# EAGLE schematic Poloneira (EAGLE 9.1.0)
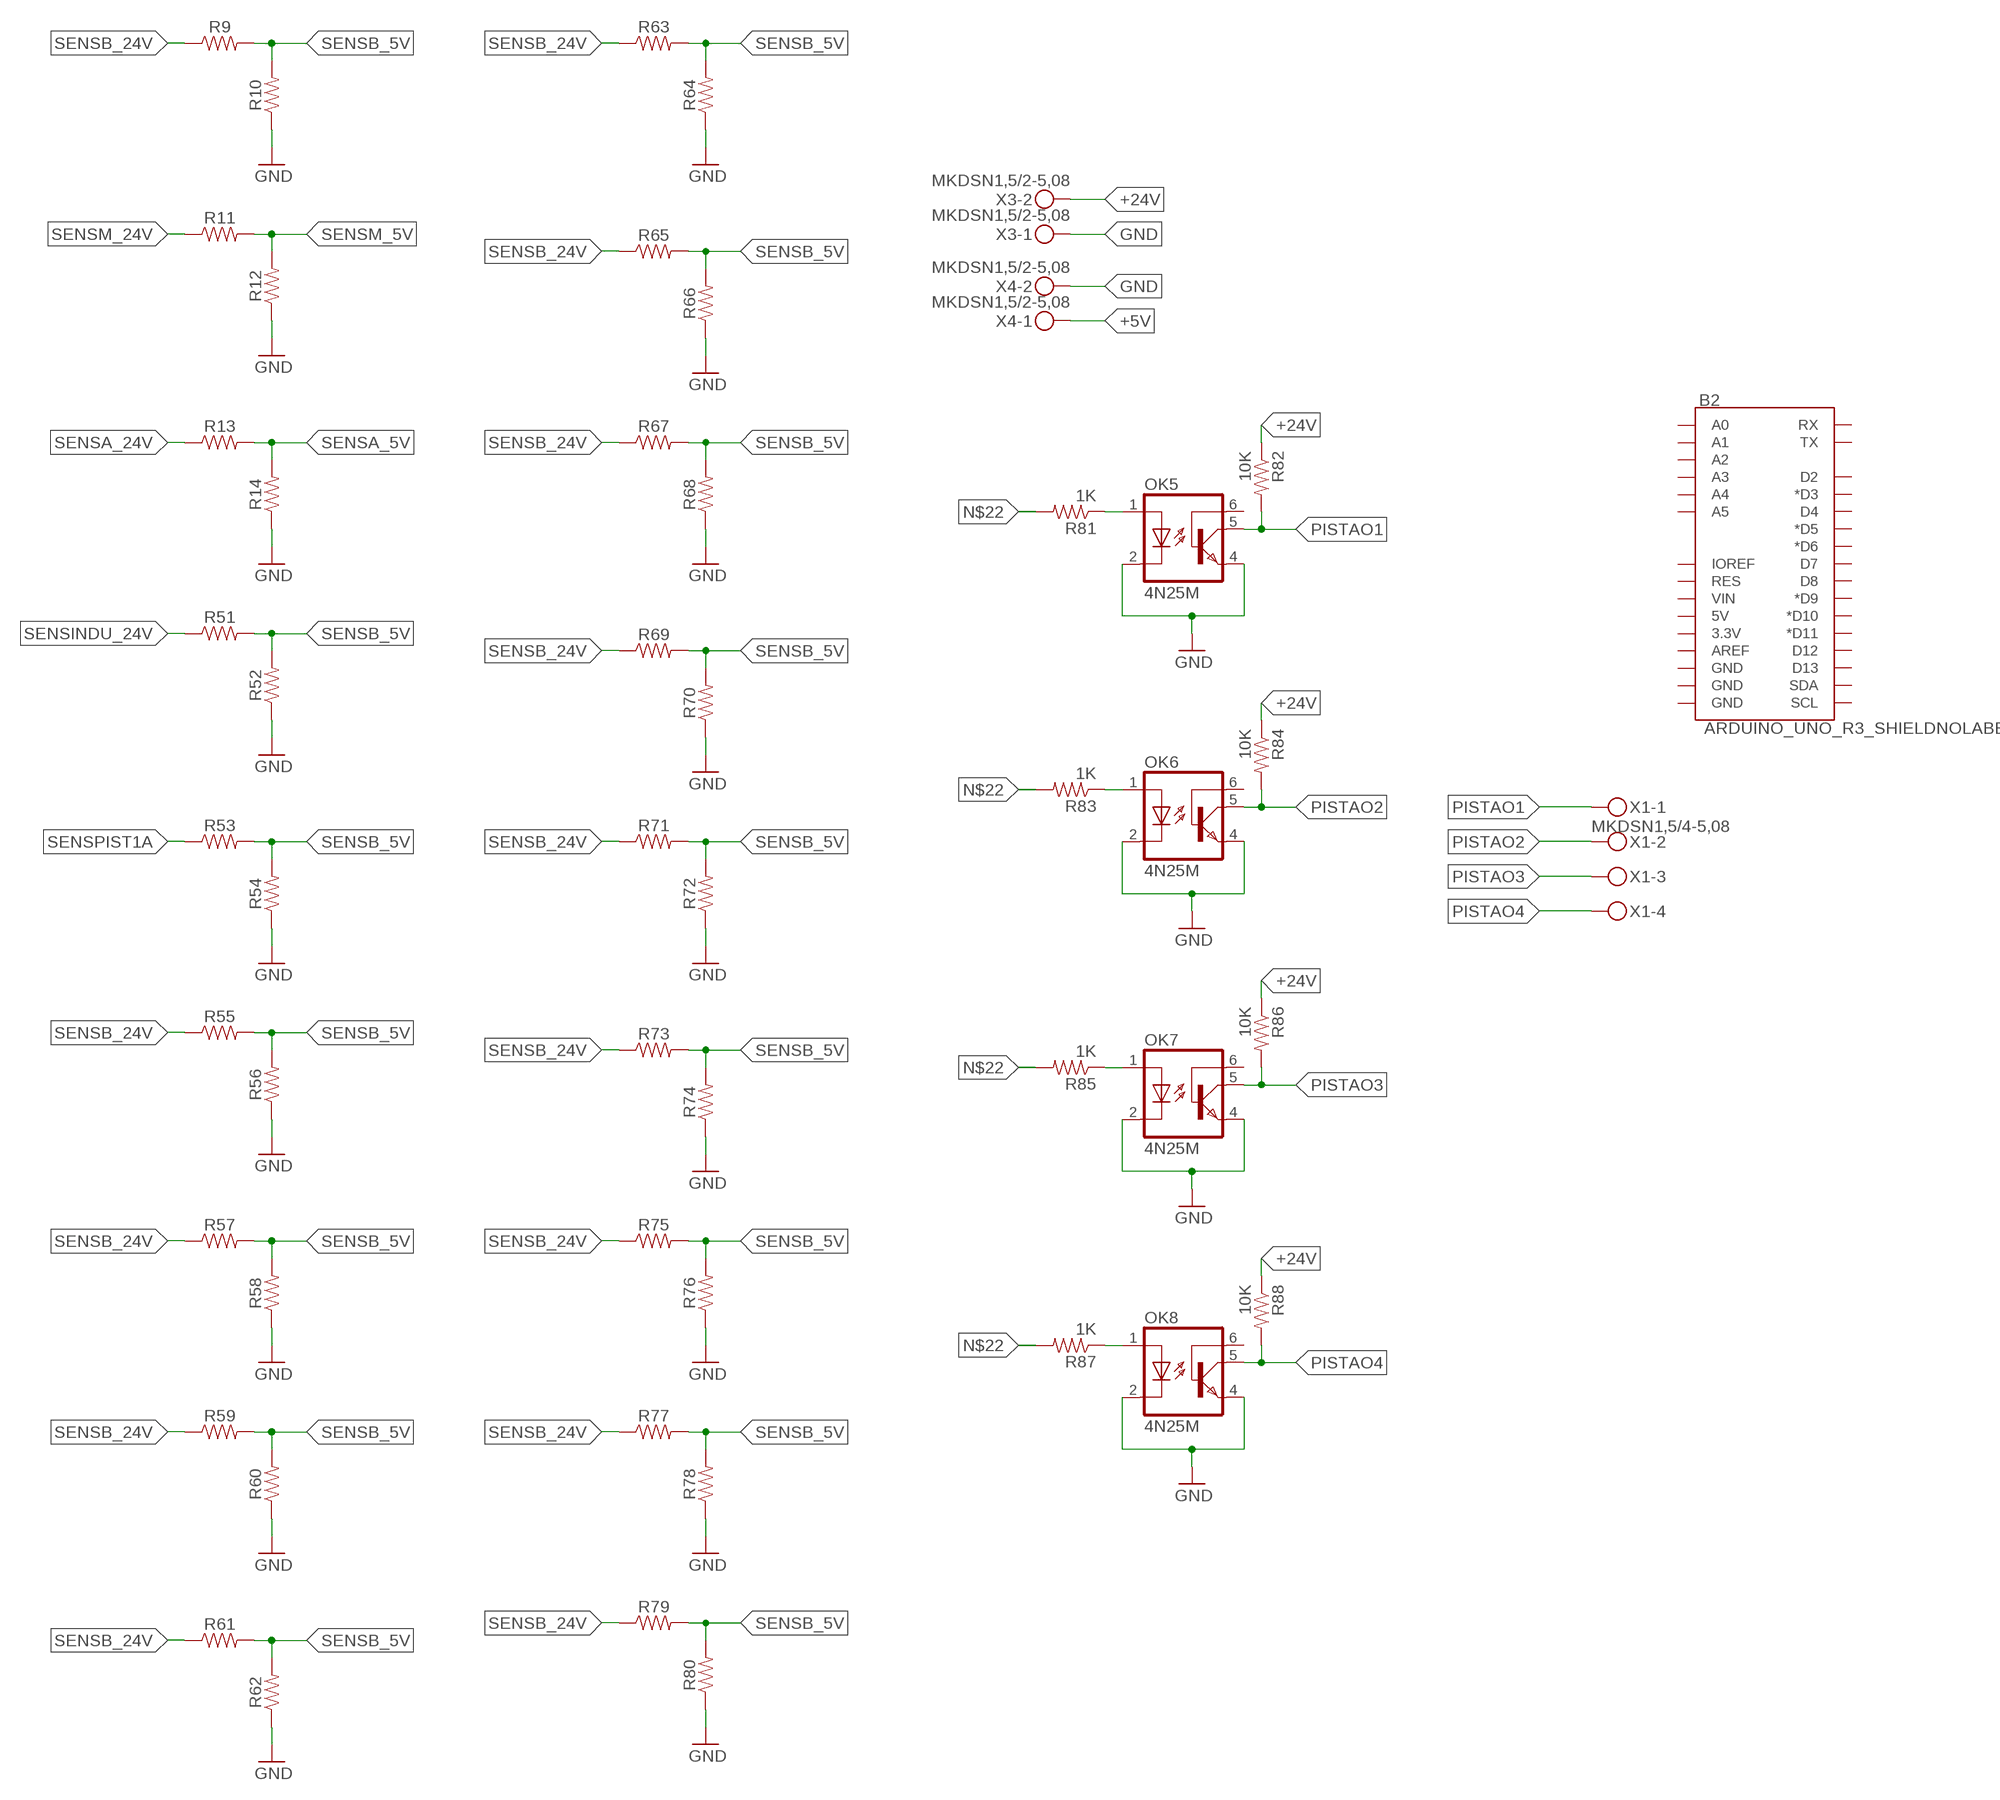
[diagram p0: schematic, sheet 1]

## Parts
B2  ARDUINO_UNO_R3_SHIELDNOLABELS  [UNO_R3_SHIELD_NOLABELS]
OK5  4N25M  [DIL06]
OK6  4N25M  [DIL06]
OK7  4N25M  [DIL06]
OK8  4N25M  [DIL06]
R9  RESISTORAXIAL-0.3-KIT  [AXIAL-0.3-KIT]
R10  RESISTORAXIAL-0.3-KIT  [AXIAL-0.3-KIT]
R11  RESISTORAXIAL-0.3-KIT  [AXIAL-0.3-KIT]
R12  RESISTORAXIAL-0.3-KIT  [AXIAL-0.3-KIT]
R13  RESISTORAXIAL-0.3-KIT  [AXIAL-0.3-KIT]
R14  RESISTORAXIAL-0.3-KIT  [AXIAL-0.3-KIT]
R51  RESISTORAXIAL-0.3-KIT  [AXIAL-0.3-KIT]
R52  RESISTORAXIAL-0.3-KIT  [AXIAL-0.3-KIT]
R53  RESISTORAXIAL-0.3-KIT  [AXIAL-0.3-KIT]
R54  RESISTORAXIAL-0.3-KIT  [AXIAL-0.3-KIT]
R55  RESISTORAXIAL-0.3-KIT  [AXIAL-0.3-KIT]
R56  RESISTORAXIAL-0.3-KIT  [AXIAL-0.3-KIT]
R57  RESISTORAXIAL-0.3-KIT  [AXIAL-0.3-KIT]
R58  RESISTORAXIAL-0.3-KIT  [AXIAL-0.3-KIT]
R59  RESISTORAXIAL-0.3-KIT  [AXIAL-0.3-KIT]
R60  RESISTORAXIAL-0.3-KIT  [AXIAL-0.3-KIT]
R61  RESISTORAXIAL-0.3-KIT  [AXIAL-0.3-KIT]
R62  RESISTORAXIAL-0.3-KIT  [AXIAL-0.3-KIT]
R63  RESISTORAXIAL-0.3-KIT  [AXIAL-0.3-KIT]
R64  RESISTORAXIAL-0.3-KIT  [AXIAL-0.3-KIT]
R65  RESISTORAXIAL-0.3-KIT  [AXIAL-0.3-KIT]
R66  RESISTORAXIAL-0.3-KIT  [AXIAL-0.3-KIT]
R67  RESISTORAXIAL-0.3-KIT  [AXIAL-0.3-KIT]
R68  RESISTORAXIAL-0.3-KIT  [AXIAL-0.3-KIT]
R69  RESISTORAXIAL-0.3-KIT  [AXIAL-0.3-KIT]
R70  RESISTORAXIAL-0.3-KIT  [AXIAL-0.3-KIT]
R71  RESISTORAXIAL-0.3-KIT  [AXIAL-0.3-KIT]
R72  RESISTORAXIAL-0.3-KIT  [AXIAL-0.3-KIT]
R73  RESISTORAXIAL-0.3-KIT  [AXIAL-0.3-KIT]
R74  RESISTORAXIAL-0.3-KIT  [AXIAL-0.3-KIT]
R75  RESISTORAXIAL-0.3-KIT  [AXIAL-0.3-KIT]
R76  RESISTORAXIAL-0.3-KIT  [AXIAL-0.3-KIT]
R77  RESISTORAXIAL-0.3-KIT  [AXIAL-0.3-KIT]
R78  RESISTORAXIAL-0.3-KIT  [AXIAL-0.3-KIT]
R79  RESISTORAXIAL-0.3-KIT  [AXIAL-0.3-KIT]
R80  RESISTORAXIAL-0.3-KIT  [AXIAL-0.3-KIT]
R81  1K  1KOHM-1/4W-1%(PTH)HORIZ-KIT  [AXIAL-0.3EZ]
R82  10K  1KOHM-1/4W-1%(PTH)HORIZ-KIT  [AXIAL-0.3EZ]
R83  1K  1KOHM-1/4W-1%(PTH)HORIZ-KIT  [AXIAL-0.3EZ]
R84  10K  1KOHM-1/4W-1%(PTH)HORIZ-KIT  [AXIAL-0.3EZ]
R85  1K  1KOHM-1/4W-1%(PTH)HORIZ-KIT  [AXIAL-0.3EZ]
R86  10K  1KOHM-1/4W-1%(PTH)HORIZ-KIT  [AXIAL-0.3EZ]
R87  1K  1KOHM-1/4W-1%(PTH)HORIZ-KIT  [AXIAL-0.3EZ]
R88  10K  1KOHM-1/4W-1%(PTH)HORIZ-KIT  [AXIAL-0.3EZ]
X1  MKDSN1,5/4-5,08  [MKDSN1,5/4-5,08]
X3  MKDSN1,5/2-5,08  [MKDSN1,5/2-5,08]
X4  MKDSN1,5/2-5,08  [MKDSN1,5/2-5,08]

## Nets
+5V: X4.1
+24V: R82.P$1 R84.P$1 R86.P$1 R88.P$1 X3.2
GND: OK5.2(C) OK5.4(EMI) OK6.2(C) OK6.4(EMI) OK7.2(C) OK7.4(EMI) OK8.2(C) OK8.4(EMI) R10.P$1 R12.P$1 R14.P$1 R52.P$1 R54.P$1 R56.P$1 R58.P$1 R60.P$1 R62.P$1 R64.P$1 R66.P$1 R68.P$1 R70.P$1 R72.P$1 R74.P$1 R76.P$1 R78.P$1 R80.P$1 X3.1 X4.2
N$4: OK5.1(A) R81.P$1
N$5: OK6.1(A) R83.P$1
N$6: OK7.1(A) R85.P$1
N$7: OK8.1(A) R87.P$1
N$22: R81.P$2 R83.P$2 R85.P$2 R87.P$2
PISTAO1: OK5.5(COL) R82.P$2 X1.1
PISTAO2: OK6.5(COL) R84.P$2 X1.2
PISTAO3: OK7.5(COL) R86.P$2 X1.3
PISTAO4: OK8.5(COL) R88.P$2 X1.4
SENSA_5V: R13.P$2 R14.P$2
SENSA_24V: R13.P$1
SENSB_5V: R9.P$2 R10.P$2 R51.P$2 R52.P$2 R53.P$2 R54.P$2 R55.P$2 R56.P$2 R57.P$2 R58.P$2 R59.P$2 R60.P$2 R61.P$2 R62.P$2 R63.P$2 R64.P$2 R65.P$2 R66.P$2 R67.P$2 R68.P$2 R69.P$2 R70.P$2 R71.P$2 R72.P$2 R73.P$2 R74.P$2 R75.P$2 R76.P$2 R77.P$2 R78.P$2 R79.P$2 R80.P$2
SENSB_24V: R9.P$1 R55.P$1 R57.P$1 R59.P$1 R61.P$1 R63.P$1 R65.P$1 R67.P$1 R69.P$1 R71.P$1 R73.P$1 R75.P$1 R77.P$1 R79.P$1
SENSINDU_24V: R51.P$1
SENSM_5V: R11.P$2 R12.P$2
SENSM_24V: R11.P$1
SENSPIST1A: R53.P$1
Unconnected: B2.3.3V B2.5V B2.A0 B2.A1 B2.A2 B2.A3 B2.A4 B2.A5 B2.AREF B2.D2 B2.D3(*D3) B2.D4 B2.D5(*D5) B2.D6(*D6) B2.D7 B2.D8 B2.D9(*D9) B2.D10(*D10) B2.D11(*D11) B2.D12 B2.D13 B2.GND@0(GND) B2.GND@1(GND) B2.GND@2(GND) B2.IOREF B2.RES B2.RX B2.SCL B2.SDA B2.TX B2.VIN OK5.6(BAS) OK6.6(BAS) OK7.6(BAS) OK8.6(BAS)

## Library data of the parts
B2 = SparkFun-Boards:ARDUINO_UNO_R3_SHIELD: Arduino R3 Shield Footprint Shield form compatible with the Arduino Uno R3. SparkFun Products: MG2639 Cellular Shield <https://www.sparkfun.com/products/13120> MIDI Shield <https://www.sparkfun.com/products/12898> R3 Stackable Headers Kit <https://www.sparkfun.com/products/11417>
OK5-OK8 = optocoupler:4N*?M: General Purpose 6-Pin Phototransistor Optocouplers Source: http://www.fairchildsemi.com/ds/4N/4N35-M.pdf; MPN: 4N25-M; OC_FARNELL: 1021349; OC_NEWARK: 98K9084
R9-R14 R51-R80 = SparkFun-Resistors:RESISTOR: Generic Resistor Package
R81 R83 R85 R87 = SparkFun-Resistors:1KOHM-1/4W-1%(PTH): RES-12182; PROD_ID: RES-12182
R82 R84 R86 R88 = SparkFun-Resistors:1KOHM-1/4W-1%(PTH): RES-12182; PROD_ID: RES-12182; VALUE: 1K
X1 = con-phoenix-508:MKDSN1,5/4-5,08: MKDSN 1,5/ 4-5,08 Printklemme Nennstrom: 13,5 A Nennspannung: 250 V Rastermaß: 5,08 mm Polzahl: 4 Anschlussart: Schraubanschluss Montage: Löten Anschlussrichtung Leiter/Platine: 0 ° Artikelnummer: 1729144 Source: http://eshop.phoenixcontact.com .. 1729144.pdf
X3 X4 = con-phoenix-508:MKDSN1,5/2-5,08: MKDSN 1,5/ 2-5,08 Printklemme Nennstrom: 13,5 A Nennspannung: 250 V Rastermaß: 5,08 mm Polzahl: 2 Anschlussart: Schraubanschluss Montage: Löten Anschlussrichtung Leiter/Platine: 0 ° Artikelnummer: 1729128 Source: http://eshop.phoenixcontact.com .. 1729128.pdf